# Altium project SynthyTwo.Project.PrjPcb (part 1 of 2)
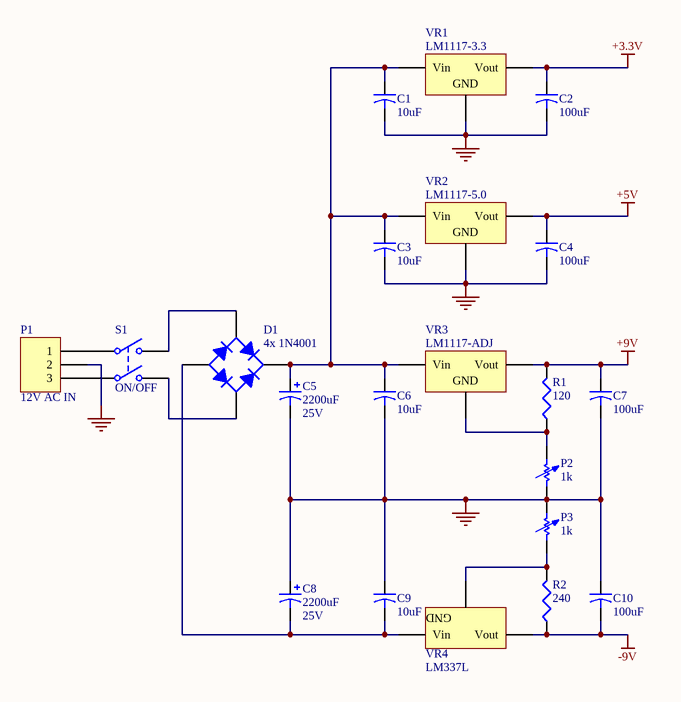
[diagram p0: PSU.Schematic.SchDoc]
11 sheets, 1148 parts. Net scope: hierarchical (ports join the sheet entries above them; power ports are global).
Board file: PCBROUTAGE.PcbDoc
Sheets:
  PSU.Schematic.SchDoc
  LINK_Filter.SchDoc
    Filtres = FilterBoard.Schematic.SchDoc
    DAC = DAC.Schematic.SchDoc
    Controle du Filtre = FilterControl.Schematic.SchDoc
    Multiplexeur = Output.Schematic.SchDoc
  LINK_PIC.SchDoc
    PIC = PIC.Schematic.SchDoc
    LED1 = Display.Schematic.SchDoc
    LED2 = Display.Schematic.SchDoc
    LED3 = Display.Schematic.SchDoc
    LED4 = Display.Schematic.SchDoc
    LED5 = Display.Schematic.SchDoc
    LED6 = Display.Schematic.SchDoc
    LED7 = Display.Schematic.SchDoc
    LED8 = Display.Schematic.SchDoc
    LED9 = Display.Schematic.SchDoc
    SWITCH 1 = Display.Schematic.SchDoc
    SWITCH 2 = Display.Schematic.SchDoc
    SWITCH 3 = Display.Schematic.SchDoc
    SWITCH 4 = Display.Schematic.SchDoc
    SWITCH 5 = Display.Schematic.SchDoc
    SCK = DAC.Schematic.SchDoc
    DATA = DAC.Schematic.SchDoc
    BCK = DAC.Schematic.SchDoc
    LRCK = DAC.Schematic.SchDoc
    RS = Display.Schematic.SchDoc
    ENABLE = Display.Schematic.SchDoc
    DATA  4 = Display.Schematic.SchDoc
    DATA 5 = Display.Schematic.SchDoc
    DATA 6 = Display.Schematic.SchDoc
    DATA 7 = Display.Schematic.SchDoc
    MIDI IN = MIDI.Schematic.SchDoc
    Frequency = FilterControl.Schematic.SchDoc
    Resonance = FilterControl.Schematic.SchDoc
    Mod = FilterControl.Schematic.SchDoc
    A0 = Output.Schematic.SchDoc
    A1 = Output.Schematic.SchDoc
    A0 = Encodeurs.Schematic.SchDoc
    A1 = Encodeurs.Schematic.SchDoc
    B0 = Encodeurs.Schematic.SchDoc
    B1 = Encodeurs.Schematic.SchDoc
    C0 = Encodeurs.Schematic.SchDoc
    C1 = Encodeurs.Schematic.SchDoc
    D0 = Encodeurs.Schematic.SchDoc
    D1 = Encodeurs.Schematic.SchDoc

## Sheet PSU.Schematic.SchDoc
size A

### Parts
C1  10uF  [CAPR5-4X5]
C2  100uF  [CAPR5-4X5]
C3  10uF  [CAPR5-4X5]
C4  100uF  [CAPR5-4X5]
C5  2200uF  value 25V  [RB7.6-15]
C6  10uF  [CAPR5-4X5]
C7  100uF  [CAPR5-4X5]
C8  2200uF  value 25V  [RB7.6-15]
C9  10uF  [CAPR5-4X5]
C10  100uF  [CAPR5-4X5]
D1  4x 1N4001  [D-38]
P1  12V AC IN  [HDR1X3]
P2  1k  [AXIAL-0.7]
P3  1k  [AXIAL-0.7]
R1  120  [J1-0603]
R2  240  [J1-0603]
S1  ON/OFF  [DPST-4]
VR1  LM1117-3.3  [D2PAK_N]
VR2  LM1117-5.0  [D2PAK_N]
VR3  LM1117-ADJ  [D2PAK_N]
VR4  LM337L  [D2PAK_N]

### Nets
+3.3V: C2.1 VR1.3(Vout)
+5V: C4.1 VR2.3(Vout)
+9V: C7.1 R1.2 VR3.3(Vout)
-9V: C10.2 R2.1 VR4.3(Vout)
GND: C1.2 C2.2 C3.2 C4.2 C5.2 C6.2 C7.2 C8.1 C9.1 C10.1 P1.2 P2.1 P3.2 VR1.2(GND) VR2.2(GND)
NetC1_1: C1.1 C3.1 C5.1 C6.1 D1.1(K) VR1.1(Vin) VR2.1(Vin) VR3.1(Vin)
NetC8_2: C8.2 C9.2 D1.3(A) VR4.1(Vin)
NetD1_2: D1.2(C) S1.4(NO2)
NetD1_4: D1.4(C) S1.2(NO1)
NetP1_1: P1.1 S1.1(COMMON1)
NetP1_3: P1.3 S1.3(COMMON2)
NetP2_2: P2.2 R1.1 VR3.2(ADJ)
NetP3_1: P3.1 R2.2 VR4.2(ADJ)

### Notes on the sheet
- (in symbol Volt Reg) GND

### Library data of the parts
C1 C3 C6 C9 = Cap2: Capacitor; Value: 10u; Published: 23-Sep-2002; PackageReference: CAPR5-4X5; Publisher: Altium Limited; PackageDescription: Capacitor; 2 Leads
C2 C4 C7 C10 = Cap2: Capacitor; Value: 100u; Published: 23-Sep-2002; PackageReference: CAPR5-4X5; Publisher: Altium Limited; PackageDescription: Capacitor; 2 Leads
C5 C8 = Cap Pol1: Polarized Capacitor (Radial); Published: 8-Jun-2000; LatestRevisionDate: 17-Jul-2002; LatestRevisionNote: Re-released for DXP Platform.; PackageReference: RB7.6-15; Publisher: Altium Limited; PackageDescription: Polarized Capacitor (Radial); 2 Leads
D1 = Bridge1: Full Wave Diode Bridge; Published: 8-Jun-2000; LatestRevisionDate: 29-May-2009; LatestRevisionNote: Sch pins A & K swapped.; DatasheetVersion: E2732B; PackageReference: D-38; Publisher: Altium Limited; PackageDescription: Bridge Rectifier; 4 Terminals; Body 9.4 x 9.4 mm (typ); Pitch 5.08 mm
P1 = Header 3: Header, 3-Pin; LatestRevisionDate: 17-Jul-2002; LatestRevisionNote: Re-released for DXP Platform.; Publisher: Altium Limited
P2 P3 = Res Adj1: Variable Resistor; Set Position: 0.5; Published: 8-Jun-2000; LatestRevisionDate: 17-Jul-2002; LatestRevisionNote: Re-released for DXP Platform.; PackageReference: AXIAL-0.7; Publisher: Altium Limited; PackageDescription: Axial Device, Thru-Hole; 2 Leads; 0.7 in Pin Spacing; Value: 1K
R1 R2 = Res3: Resistor; Published: 8-Jun-2000; LatestRevisionDate: 29-May-2009; LatestRevisionNote: IPC-7351 Footprint Added.; PackageReference: J1-0603; Publisher: Altium Limited; PackageDescription: Chip Resistor
  R1: Value: 120
  R2: Value: 240
S1 = SW-DPST: Double-Pole, Single-Throw Switch; Published: 24-Mar-1999; LatestRevisionDate: 17-Jul-2002; LatestRevisionNote: Re-released for DXP Platform.; PackageReference: DPST-4; Publisher: Altium Limited; PackageDescription: Switch; 4 Leads
VR1-VR4 = Volt Reg: Voltage Regulator; Published: 24-Mar-1999; LatestRevisionDate: 29-May-2009; LatestRevisionNote: IPC-7351 Footprint Added.; PackageReference: D2PAK; Publisher: Altium Limited; PackageDescription: 3-Pin Transistor Outline Package 2.54 mm Pitch, 15.1 mm Lead Span

## Sheet LINK_Filter.SchDoc
size A
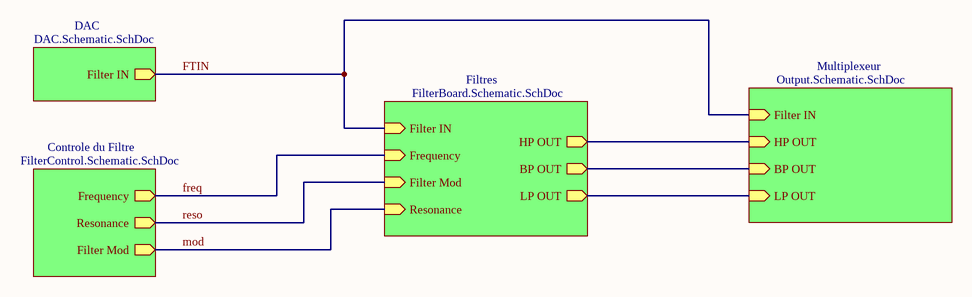
[diagram p1: LINK_Filter.SchDoc]

### Sub-sheets
Controle du Filtre = FilterControl.Schematic.SchDoc: Frequency (out), Resonance (out), Filter Mod (out)
DAC = DAC.Schematic.SchDoc: Filter IN (out)
Filtres = FilterBoard.Schematic.SchDoc: Filter IN (in), Filter Mod (in), Frequency (in), Resonance (in), BP OUT (out), HP OUT (out), LP OUT (out)
Multiplexeur = Output.Schematic.SchDoc: Filter IN (in), BP OUT (in), HP OUT (in), LP OUT (in)

### Nets
BPO: sheet Filtres/BP OUT, sheet Multiplexeur/BP OUT
freq: sheet Filtres/Frequency, sheet Controle du Filtre/Frequency
FTIN: sheet Filtres/Filter IN, sheet DAC/Filter IN, sheet Multiplexeur/Filter IN
HPO: sheet Filtres/HP OUT, sheet Multiplexeur/HP OUT
LPO: sheet Filtres/LP OUT, sheet Multiplexeur/LP OUT
mod: sheet Filtres/Resonance, sheet Controle du Filtre/Filter Mod
reso: sheet Filtres/Filter Mod, sheet Controle du Filtre/Resonance

## Sheet FilterBoard.Schematic.SchDoc
size B
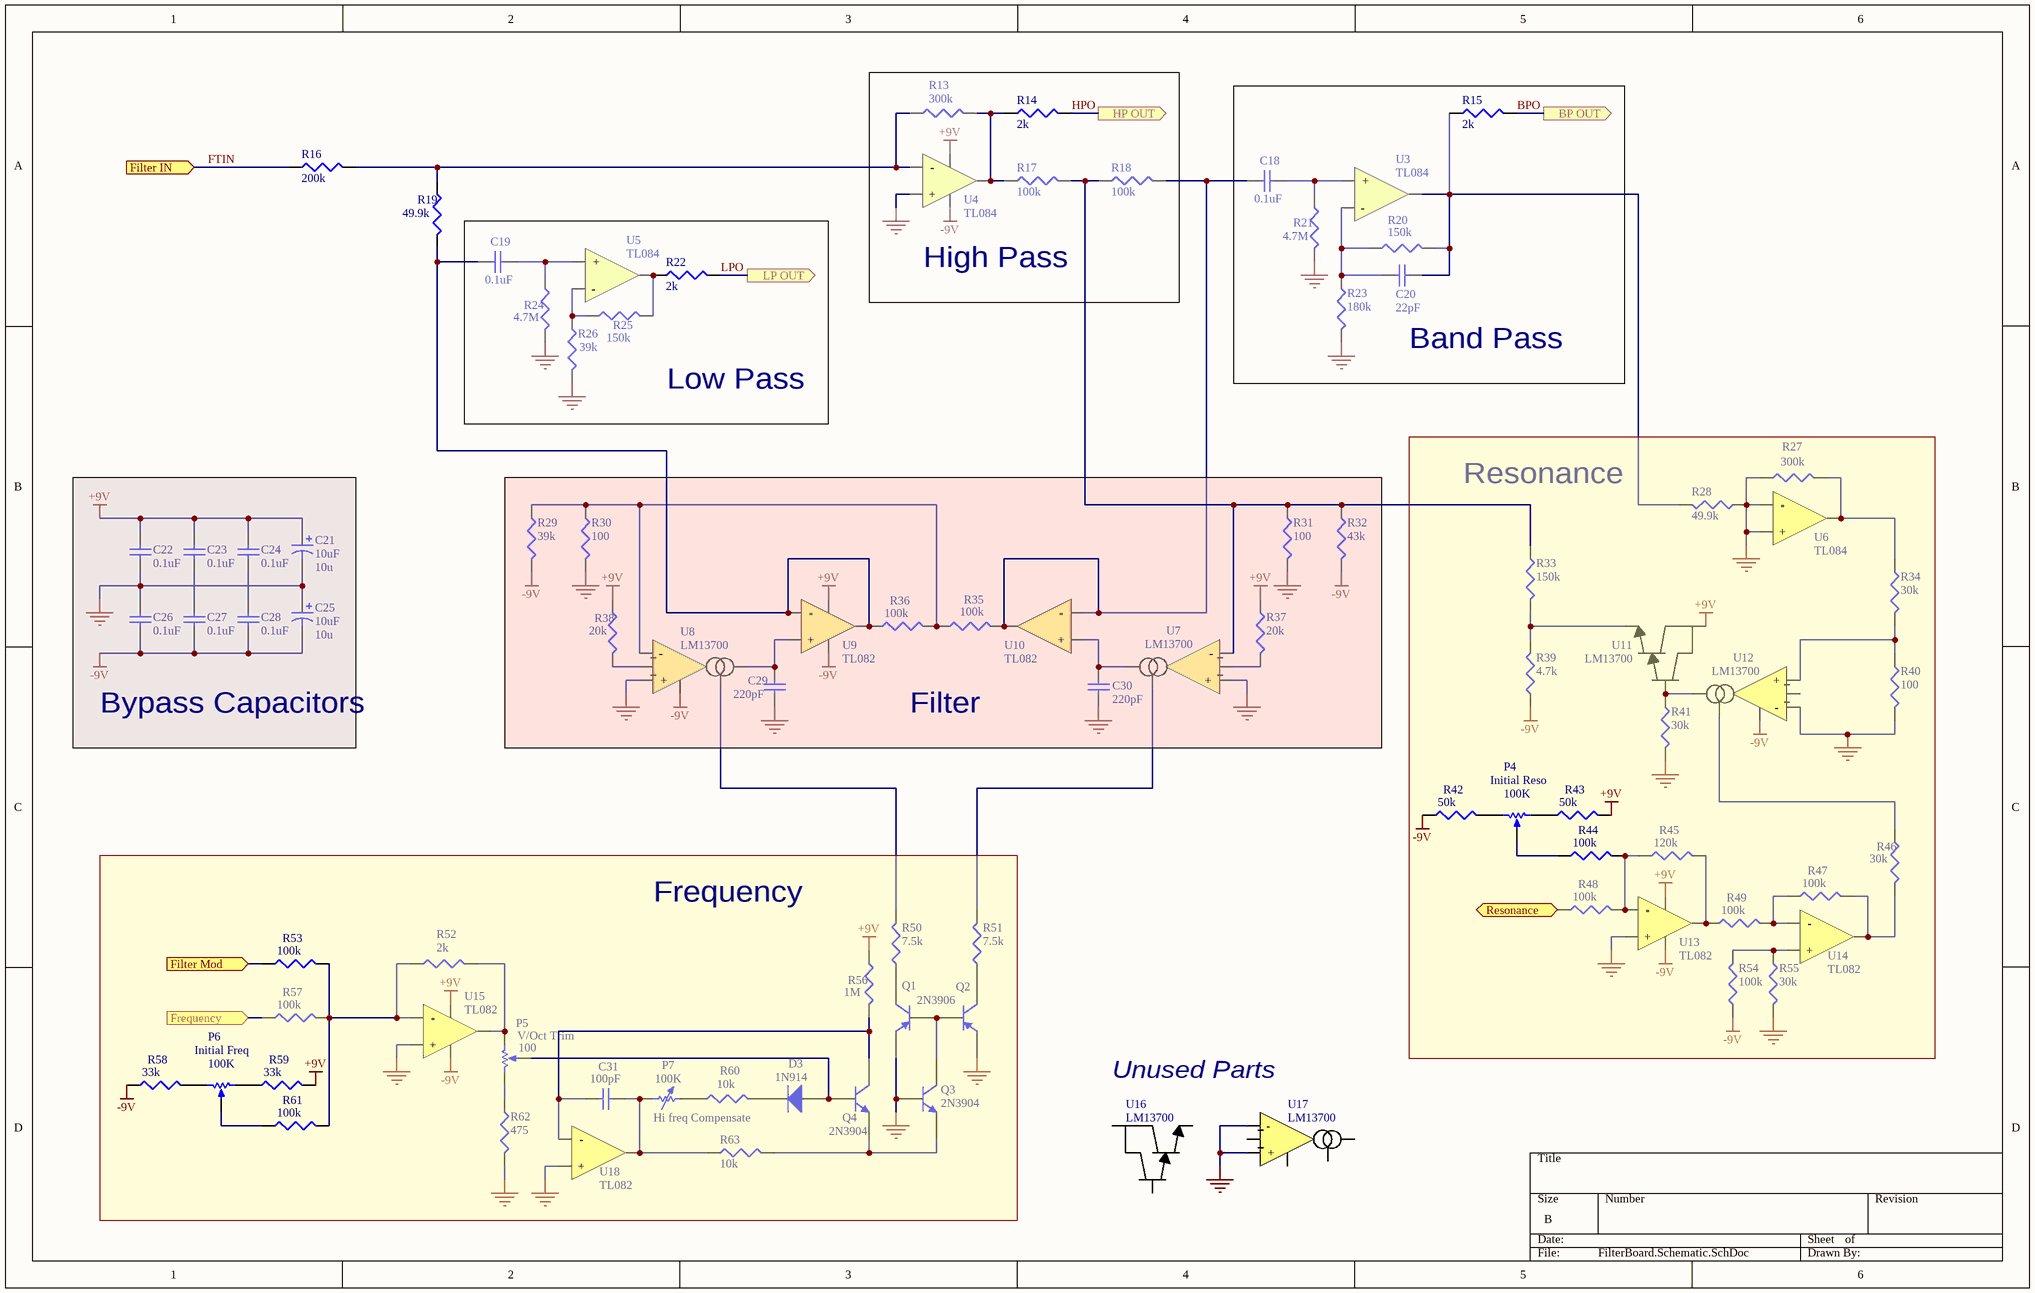
[diagram p2: FilterBoard.Schematic.SchDoc]

### Parts
C18  0.1uF  [C1206]
C19  0.1uF  [C1206]
C20  22pF  [C1206]
C21  10uF  value 10u  [RB7.6-15]
C22  0.1uF  [C1206]
C23  0.1uF  [C1206]
C24  0.1uF  [C1206]
C25  10uF  value 10u  [RB7.6-15]
C26  0.1uF  [C1206]
C27  0.1uF  [C1206]
C28  0.1uF  [C1206]
C29  220pF  [C1206]
C30  220pF  [C1206]
C31  100pF  [C1206]
D3  1N914  [DO-41]
P4  Initial Reso  value 100K  [VR5]
P5  V/Oct Trim  value 100  [VR5]
P6  Initial Freq  value 100K  [VR5]
P7  Hi freq Compensate  value 100K  [AXIAL-0.7]
Q1  2N3906  [TO-92A]
Q2  2N3906  [TO-92A]  (value not drawn)
Q3  2N3904  [TO-92A]
Q4  2N3904  [TO-92A]
R13  300k  [J1-0603]
R14  2k  [J1-0603]
R15  2k  [J1-0603]
R16  200k  [J1-0603]
R17  100k  [J1-0603]
R18  100k  [J1-0603]
R19  49.9k  [J1-0603]
R20  150k  [J1-0603]
R21  4.7M  [J1-0603]
R22  2k  [J1-0603]
R23  180k  [J1-0603]
R24  4.7M  [J1-0603]
R25  150k  [J1-0603]
R26  39k  [J1-0603]
R27  300k  [J1-0603]
R28  49.9k  [J1-0603]
R29  39k  [J1-0603]
R30  100  [J1-0603]
R31  100  [J1-0603]
R32  43k  [J1-0603]
R33  150k  [J1-0603]
R34  30k  [J1-0603]
R35  100k  [J1-0603]
R36  100k  [J1-0603]
R37  20k  [J1-0603]
R38  20k  [J1-0603]
R39  4.7k  [J1-0603]
R40  100  [J1-0603]
R41  30k  [J1-0603]
R42  50k  [J1-0603]
R43  50k  [J1-0603]
R44  100k  [J1-0603]
R45  120k  [J1-0603]
R46  30k  [J1-0603]
R47  100k  [J1-0603]
R48  100k  [J1-0603]
R49  100k  [J1-0603]
R50  7.5k  [J1-0603]
R51  7.5k  [J1-0603]
R52  2k  [J1-0603]
R53  100k  [J1-0603]
R54  100k  [J1-0603]
R55  30k  [J1-0603]
R56  1M  [J1-0603]
R57  100k  [J1-0603]
R58  33k  [J1-0603]
R59  33k  [J1-0603]
R60  10k  [J1-0603]
R61  100k  [J1-0603]
R62  475  [J1-0603]
R63  10k  [J1-0603]
U3  TL084
U4  TL084
U5  TL084
U6  TL084
U7  LM13700
U8  LM13700
U9  TL082
U10  TL082
U11  LM13700
U12  LM13700
U13  TL082
U14  TL082
U15  TL082
U16  LM13700
U17  LM13700
U18  TL082

### Blocks framed on the sheet
High Pass: R13 R14 R17 R18 U4
Band Pass: C18 C20 R15 R20 R21 R23 U3
Low Pass: C19 R22 R24-R26 U5
Resonance: P4 R27 R28 R33 R34 R39-R49 R54 R55 U6 U11-U14
Bypass Capacitors: C21-C28
Filter: C29 C30 R29-R32 R35-R38 U7-U10
Frequency: C31 D3 P5-P7 Q1-Q4 R50-R53 R56-R63 U15 U18

### Ports
BP OUT (out), Filter IN (in), Filter Mod (in), Frequency (in), HP OUT (out), LP OUT (out), Resonance (in)

### Nets
+9V: C21.1 C22.2 C23.2 C24.2 R37.1 R38.1 R43.2 R56.1 R59.2 U4.4(VCC+) U9.8(VCC+) U11.11(V+) U13.8(VCC+) U15.8(VCC+)
-9V: C25.2 C26.1 C27.1 C28.1 R29.2 R32.2 R39.1 R42.1 R54.1 R58.1 U4.11(VCC-) U8.6(VCC-) U9.4(VCC-) U12.6(VCC-) U13.4(VCC-) U15.4(VCC-)
GND: C21.2 C22.1 C25.1 C26.2 C29.1 C30.1 Q1.1(E) Q2.1(E) Q3.2(B) R21.2 R23.2 R24.2 R26.2 R27.1 R28.1 R30.2 R31.2 R40.2 R41.2 R55.2 R62.2 U4.3(+) U6.12(-) U6.13(+) U7.3(+) U8.3(+) U12.3(-) U13.3(+) U15.3(+) U17.3(+) U17.4(-) U18.5(+)
BPO: R15.2 ; port BP OUT
freq: R57.1 ; port Frequency
FTIN: R16.1 ; port Filter IN
HPO: R14.2 ; port HP OUT
LPO: R22.2 ; port LP OUT
mod: R48.1 ; port Resonance
reso: R53.1 ; port Filter Mod
NetC18_1: C18.1 R18.2 R35.2 U10.6(-) U10.7(OUT)
NetC18_2: C18.2 R21.1 U3.5(+)
NetC19_1: C19.1 R19.2 R36.1 U9.1(OUT) U9.2(-)
NetC19_2: C19.2 R24.1 U5.5(+)
NetC20_1: C20.1 R20.1 R23.1 U3.3(-)
NetC20_2: C20.2 R15.1 R20.2 R28.2 U3.7(OUT)
NetC23_1: C23.1 C27.2
NetC24_1: C24.1 C28.2
NetC29_2: C29.2 U8.5(OUT) U9.3(+)
NetC30_2: C30.2 U7.5(OUT) U10.5(+)
NetC31_1: C31.1 Q4.3(C) R56.2 U18.6(-)
NetC31_2: C31.2 P7.1 R63.1 U18.7(OUT)
NetD3_1: D3.1(A) P5.3(TAP) Q4.2(B)
NetD3_2: D3.2(K) R60.2
NetP4_1: P4.1(TOP) R43.1
NetP4_2: P4.2(BOT) R42.2
NetP4_3: P4.3(TAP) R44.1
NetP5_1: P5.1(TOP) R52.2 U15.1(OUT)
NetP5_2: P5.2(BOT) R62.1
NetP6_1: P6.1(TOP) R59.1
NetP6_2: P6.2(BOT) R58.2
NetP6_3: P6.3(TAP) R61.1
NetP7_2: P7.2 R60.1
NetQ1_2: Q1.2(B) Q2.2(B) Q3.3(C)
NetQ1_3: Q1.3(C) R50.1
NetQ2_3: Q2.3(C) R51.1
NetQ3_1: Q3.1(E) Q4.1(E) R63.2
NetR13_1: R13.1 R16.2 R19.1 U4.2(-)
NetR13_2: R13.2 R14.1 R17.1 U4.1(OUT)
NetR17_2: R17.2 R18.1 R31.1 R32.1 R33.1 U7.4(-)
NetR22_1: R22.1 R25.2 U5.7(OUT)
NetR25_1: R25.1 R26.1 U5.3(-)
NetR27_2: R27.2 R34.1 U6.14(OUT)
NetR29_1: R29.1 R30.1 R35.1 R36.2 U8.4(-)
NetR33_2: R33.2 R39.2 U11.8(BOUT)
NetR34_2: R34.2 R40.1 U12.4(+)
NetR37_2: R37.2 U7.2
NetR38_2: R38.2 U8.2
NetR41_1: R41.1 U11.7(BIN) U12.5(OUT)
NetR44_2: R44.2 R45.1 R48.2 U13.2(-)
NetR45_2: R45.2 R49.1 U13.1(OUT)
NetR46_1: R46.1 U12.1(BIAS)
NetR46_2: R46.2 R47.2 U14.7(OUT)
NetR47_1: R47.1 R49.2 U14.6(-)
NetR50_2: R50.2 U8.1(BIAS)
NetR51_2: R51.2 U7.1(BIAS)
NetR52_1: R52.1 R53.2 R57.2 R61.2 U15.2(-)
NetR54_2: R54.2 R55.1 U14.5(+)

Not connected (* = marked no-connect by the designer): U3 6(VCC+) 11(VCC-); U5 6(VCC+) 11(VCC-); U6 1(VCC+) 11(VCC-); U7 6(VCC-); U10 4(VCC-) 8(VCC+); U12 2; U14 4(VCC-) 8(VCC+); U16 7(BIN) 8(BOUT) 11(V+); U17 1(BIAS) 2 5(OUT) 6(VCC-); U18 4(VCC-) 8(VCC+)

### Notes on the sheet
- Unused Parts

### Library data of the parts
C18 C19 C22-C24 C26-C28 = Cap Semi: Capacitor (Semiconductor SIM Model); Value: 0.1u; Published: 8-Jun-2000; LatestRevisionDate: 29-May-2009; LatestRevisionNote: IPC-7351 Footprint Added.; PackageReference: C1206; Publisher: Altium Limited; PackageDescription: Chip Capacitor
C20 = Cap Semi: Capacitor (Semiconductor SIM Model); Value: 22p; Published: 8-Jun-2000; LatestRevisionDate: 29-May-2009; LatestRevisionNote: IPC-7351 Footprint Added.; PackageReference: C1206; Publisher: Altium Limited; PackageDescription: Chip Capacitor
C21 C25 = Cap Pol1: Polarized Capacitor (Radial); Published: 8-Jun-2000; LatestRevisionDate: 17-Jul-2002; LatestRevisionNote: Re-released for DXP Platform.; PackageReference: RB7.6-15; Publisher: Altium Limited; PackageDescription: Polarized Capacitor (Radial); 2 Leads
C29 C30 = Cap Semi: Capacitor (Semiconductor SIM Model); Value: 220p; Published: 8-Jun-2000; LatestRevisionDate: 29-May-2009; LatestRevisionNote: IPC-7351 Footprint Added.; PackageReference: C1206; Publisher: Altium Limited; PackageDescription: Chip Capacitor
C31 = Cap Semi: Capacitor (Semiconductor SIM Model); Value: 100p; Published: 8-Jun-2000; LatestRevisionDate: 29-May-2009; LatestRevisionNote: IPC-7351 Footprint Added.; PackageReference: C1206; Publisher: Altium Limited; PackageDescription: Chip Capacitor
D3 = Diode 1N4001: 1 Amp General Purpose Rectifier; Published: 8-Jun-2000; LatestRevisionDate: 17-Jul-2002; LatestRevisionNote: Re-released for DXP Platform.; DatasheetVersion: 1998; PackageVersion: Aug-1999; PackageReference: DO-41; Publisher: Altium Limited; PackageDescription: Diode, Axial; Body 5.2 x 2.7 mm (LxDia. max), Lead Dia. 0.86 mm (max); Code_JEDEC: DO-204-AL; ComponentLink1Description: Manufacturer Link; ComponentLink1URL: http://www.fairchildsemi.com/; ComponentLink2Description: Datasheet; ComponentLink2URL: http://www.fairchildsemi.com/ds/1N%2F1N4001.pdf
P4-P6 = RPot: Potentiometer; Sim Note: Enter the Resistance value and the set point into parameter fields.; Set Position: 0.5; Published: 8-Jun-2000; LatestRevisionDate: 17-Jul-2002; LatestRevisionNote: Re-released for DXP Platform.; PackageReference: VR5; Publisher: Altium Limited; PackageDescription: Variable Resistor, Thru-Hole; 3 Leads
P7 = Res Adj1: Variable Resistor; Set Position: 0.5; Published: 8-Jun-2000; LatestRevisionDate: 17-Jul-2002; LatestRevisionNote: Re-released for DXP Platform.; PackageReference: AXIAL-0.7; Publisher: Altium Limited; PackageDescription: Axial Device, Thru-Hole; 2 Leads; 0.7 in Pin Spacing
Q1 Q2 = 2N3906: PNP General Purpose Amplifier; Published: 8-Jun-2000; LatestRevisionDate: 15-Jan-2003; LatestRevisionNote: PCB Footprint 'BCY-W3/D4.7' replaced; DatasheetVersion: 1997; PackageVersion: Sep-1998; PackageReference: TO-92A; Publisher: Altium Limited; PackageDescription: TO, Flat Index; 3 In-Line, Axial Leads; Body Dia. 4.5mm; Leads 0.51 x 0.48 mm (max); ComponentLink1Description: Manufacturer Link; ComponentLink1URL: http://www.fairchildsemi.com/; ComponentLink2Description: Datasheet; ComponentLink2URL: http://www.fairchildsemi.com/ds/2N%2F2N3906.pdf
Q3 Q4 = 2N3904: NPN General Purpose Amplifier; Published: 8-Jun-2000; LatestRevisionDate: 15-Jan-2003; LatestRevisionNote: PCB Footprint 'BCY-W3/D4.7' replaced; DatasheetVersion: 1997; PackageVersion: Sep-1998; PackageReference: TO-92A; Publisher: Altium Limited; PackageDescription: TO, Flat Index; 3 In-Line, Axial Leads; Body Dia. 4.5mm; Leads 0.51 x 0.48 mm (max); ComponentLink1Description: Manufacturer Link; ComponentLink1URL: http://www.fairchildsemi.com/; ComponentLink2Description: Datasheet; ComponentLink2URL: http://www.fairchildsemi.com/ds/2N%2F2N3904.pdf
R13-R63 = Res3: Resistor; Published: 8-Jun-2000; LatestRevisionDate: 29-May-2009; LatestRevisionNote: IPC-7351 Footprint Added.; PackageReference: J1-0603; Publisher: Altium Limited; PackageDescription: Chip Resistor
  R13 R27: Value: 300K
  R14 R15 R22 R52: Value: 2K
  R16: Value: 200K
  R17 R18 R35 R36 R44 R47-R49 R53 R54 R57 R61: Value: 100K
  R19 R28: Value: 49.9K
  R20 R25 R33: Value: 150K
  R21 R24: Value: 4.7M
  R23: Value: 180K
  R26 R29: Value: 39K
  R30 R31 R40: Value: 100
  R32: Value: 43K
  R34 R41 R46 R55: Value: 30K
  R37 R38: Value: 20K
  R39: Value: 4.7K
  R42 R43: Value: 50K
  R45: Value: 120K
  R50 R51: Value: 7.5K
  R56: Value: 1M
  R58 R59: Value: 33K
  R60 R63: Value: 10K
  R62: Value: 475
U11 U16 = LM13700_1

## Sheet DAC.Schematic.SchDoc
size A
Used 5 times, as channels DAC, SCK, DATA, BCK, LRCK. Parts and nets are listed once, with the designators drawn on the sheet.
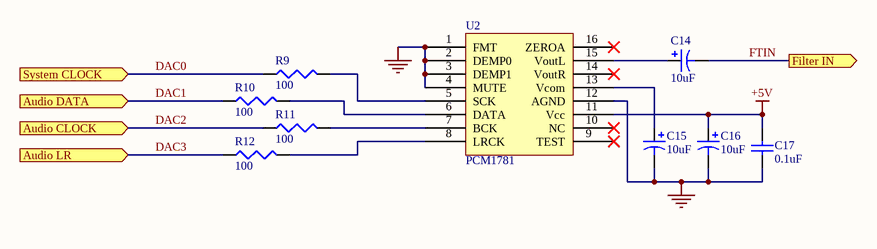
[diagram p3: DAC.Schematic.SchDoc]

### Parts
C14  10uF  [RB7.6-15]
C15  10uF  [RB7.6-15]
C16  10uF  [RB7.6-15]
C17  0.1uF  [C1206]
R9  100  [J1-0603]
R10  100  [J1-0603]
R11  100  [J1-0603]
R12  100  [J1-0603]
U2  PCM1781  [PCM1781]

### Ports
Audio CLOCK (in), Audio DATA (in), Audio LR (in), Filter IN (out), System CLOCK (in)

### Nets
+5V: C16.1 C17.2 U2.11(Vcc)
NetC15_2: C15.2 C16.2 C17.1 U2.1(FMT) U2.2(DEMP0) U2.3(DEMP1) U2.4(MUTE) U2.12(AGND)
DAC0: R9.1 ; port System CLOCK
DAC1: R10.1 ; port Audio DATA
DAC2: R11.1 ; port Audio CLOCK
DAC3: R12.1 ; port Audio LR
FTIN: C14.2 ; port Filter IN
NetC14_1: C14.1 U2.15(VoutL)
NetC15_1: C15.1 U2.13(Vcom)
NetR9_2: R9.2 U2.5(SCK)
NetR10_2: R10.2 U2.6(DATA)
NetR11_2: R11.2 U2.7(BCK)
NetR12_2: R12.2 U2.8(LRCK)

Not connected (* = marked no-connect by the designer): U2 9(TEST)* 10(NC)* 14(VoutR)* 16(ZEROA)*

### Channels
DAC: designators end in _DAC; ports Audio CLOCK=DAC2_DAC Audio DATA=DAC1_DAC Audio LR=DAC3_DAC Filter IN=FTIN System CLOCK=DAC0_DAC
SCK: designators end in _SCK; ports Audio CLOCK=DAC2_SCK Audio DATA=DAC1_SCK Audio LR=DAC3_SCK Filter IN=FTIN_SCK System CLOCK=DAC0
DATA: designators end in _DATA; ports Audio CLOCK=DAC2_DATA Audio DATA=DAC1 Audio LR=DAC3_DATA Filter IN=FTIN_DATA System CLOCK=DAC0_DATA
BCK: designators end in _BCK; ports Audio CLOCK=DAC2 Audio DATA=DAC1_BCK Audio LR=DAC3_BCK Filter IN=FTIN_BCK System CLOCK=DAC0_BCK
LRCK: designators end in _LRCK; ports Audio CLOCK=DAC2_LRCK Audio DATA=DAC1_LRCK Audio LR=DAC3 Filter IN=FTIN_LRCK System CLOCK=DAC0_LRCK

### Library data of the parts
C14-C16 = Cap Pol1: Polarized Capacitor (Radial); Published: 8-Jun-2000; LatestRevisionDate: 17-Jul-2002; LatestRevisionNote: Re-released for DXP Platform.; PackageReference: RB7.6-15; Publisher: Altium Limited; PackageDescription: Polarized Capacitor (Radial); 2 Leads; Value: 10uF
C17 = Cap Semi: as C18 on sheet FilterBoard.Schematic; Published: 8-Jun-2000; LatestRevisionDate: 29-May-2009; LatestRevisionNote: IPC-7351 Footprint Added.; PackageReference: C1206; Publisher: Altium Limited; PackageDescription: Chip Capacitor
R9-R12 = Res3: Resistor; Published: 8-Jun-2000; LatestRevisionDate: 29-May-2009; LatestRevisionNote: IPC-7351 Footprint Added.; PackageReference: J1-0603; Publisher: Altium Limited; PackageDescription: Chip Resistor; Value: 100
U2 = PCM1781 DAC

## Sheet FilterControl.Schematic.SchDoc
size A
Used 4 times, as channels Controle du Filtre, Frequency, Resonance, Mod. Parts and nets are listed once, with the designators drawn on the sheet.
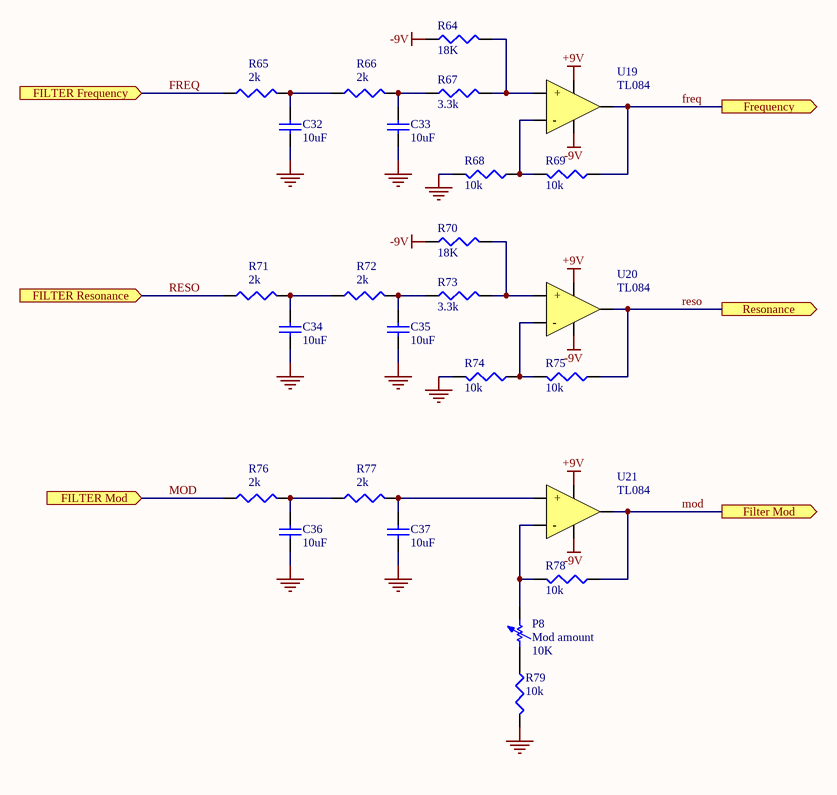
[diagram p4: FilterControl.Schematic.SchDoc]

### Parts
C32  10uF  [C1206]
C33  10uF  [C1206]
C34  10uF  [C1206]
C35  10uF  [C1206]
C36  10uF  [C1206]
C37  10uF  [C1206]
P8  Mod amount  value 10K  [AXIAL-0.7]
R64  18K  [J1-0603]
R65  2k  [J1-0603]
R66  2k  [J1-0603]
R67  3.3k  [J1-0603]
R68  10k  [J1-0603]
R69  10k  [J1-0603]
R70  18K  [J1-0603]
R71  2k  [J1-0603]
R72  2k  [J1-0603]
R73  3.3k  [J1-0603]
R74  10k  [J1-0603]
R75  10k  [J1-0603]
R76  2k  [J1-0603]
R77  2k  [J1-0603]
R78  10k  [J1-0603]
R79  10k  [J1-0603]
U19  TL084
U20  TL084
U21  TL084

### Ports
FILTER Frequency (in), FILTER Mod (in), Filter Mod (out), FILTER Resonance (in), Frequency (out), Resonance (out)

### Nets
+9V: U19.4(VCC+) U20.4(VCC+) U21.4(VCC+)
-9V: R64.1 R70.1 U19.11(VCC-) U20.11(VCC-) U21.11(VCC-)
GND: C32.1 C33.1 C34.1 C35.1 C36.1 C37.1 R68.2 R74.2 R79.2
FREQ: R65.1 R69.1 U19.1(OUT) ; port Frequency, port FILTER Frequency
MOD: R76.1 R78.1 U21.1(OUT) ; port Filter Mod, port FILTER Mod
RESO: R71.1 R75.1 U20.1(OUT) ; port Resonance, port FILTER Resonance
NetC32_2: C32.2 R65.2 R66.1
NetC33_2: C33.2 R66.2 R67.1
NetC34_2: C34.2 R71.2 R72.1
NetC35_2: C35.2 R72.2 R73.1
NetC36_2: C36.2 R76.2 R77.1
NetC37_2: C37.2 R77.2 U21.2(+)
NetP8_1: P8.1 R79.1
NetP8_2: P8.2 R78.2 U21.3(-)
NetR64_2: R64.2 R67.2 U19.2(+)
NetR68_1: R68.1 R69.2 U19.3(-)
NetR70_2: R70.2 R73.2 U20.2(+)
NetR74_1: R74.1 R75.2 U20.3(-)

### Channels
Controle du Filtre: designators end in _Controle_du_Filtre; ports FILTER Frequency=freq Filter Mod=mod FILTER Mod=mod FILTER Resonance=reso Frequency=freq Resonance=reso
Frequency: designators end in _Frequency; ports FILTER Frequency=FREQ Filter Mod=MOD_Frequency FILTER Mod=MOD_Frequency FILTER Resonance=RESO_Frequency Frequency=FREQ Resonance=RESO_Frequency
Resonance: designators end in _Resonance; ports FILTER Frequency=FREQ_Resonance Filter Mod=MOD_Resonance FILTER Mod=MOD_Resonance FILTER Resonance=RESO Frequency=FREQ_Resonance Resonance=RESO
Mod: designators end in _Mod; ports FILTER Frequency=FREQ_Mod Filter Mod=MOD FILTER Mod=MOD FILTER Resonance=RESO_Mod Frequency=FREQ_Mod Resonance=RESO_Mod

### Library data of the parts
C32-C37 = Cap Semi: Capacitor (Semiconductor SIM Model); Value: 10u; Published: 8-Jun-2000; LatestRevisionDate: 29-May-2009; LatestRevisionNote: IPC-7351 Footprint Added.; PackageReference: C1206; Publisher: Altium Limited; PackageDescription: Chip Capacitor
P8 = Res Adj1: Variable Resistor; Set Position: 0.5; Published: 8-Jun-2000; LatestRevisionDate: 17-Jul-2002; LatestRevisionNote: Re-released for DXP Platform.; PackageReference: AXIAL-0.7; Publisher: Altium Limited; PackageDescription: Axial Device, Thru-Hole; 2 Leads; 0.7 in Pin Spacing
R64-R79 = Res3: Resistor; Published: 8-Jun-2000; LatestRevisionDate: 29-May-2009; LatestRevisionNote: IPC-7351 Footprint Added.; PackageReference: J1-0603; Publisher: Altium Limited; PackageDescription: Chip Resistor
  R64 R70: Value: 18K
  R65 R66 R71 R72 R76 R77: Value: 2K
  R67 R73: Value: 3.3K
  R68 R69 R74 R75 R78 R79: Value: 10K

## Sheet Output.Schematic.SchDoc
size A
Used 3 times, as channels Multiplexeur, A0, A1. Parts and nets are listed once, with the designators drawn on the sheet.
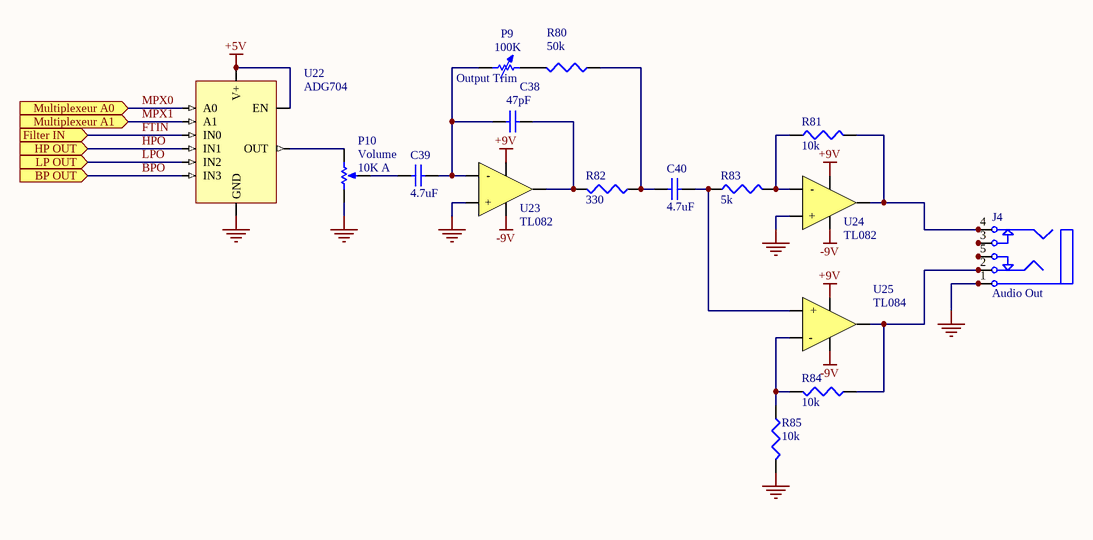
[diagram p5: Output.Schematic.SchDoc]

### Parts
C38  47pF  [CAPC1608N]
C39  4.7uF  [CAP1608N]
C40  4.7uF  [CAPC1608N]
J4  Audio Out  [ST-3150-5N]
P9  Output Trim  value 100K  [AXIAL-0.7]
P10  Volume  value 10K A  [VR5]
R80  50k  [CAPC1608N]
R81  10k  [CAPC1608N]
R82  330  [CAPC1608N]
R83  5k  [CAPC1608N]
R84  10k  [J1-0603]
R85  10k  [RESC6332]
U22  ADG704
U23  TL082
U24  TL082
U25  TL084

### Ports
BP OUT (in), Filter IN (in), HP OUT (in), LP OUT (in), Multiplexeur A0 (in), Multiplexeur A1 (in)

### Nets
+5V: U22.5(EN) U22.6(V+)
+9V: U23.8(VCC+) U24.8(VCC+) U25.4(VCC+)
-9V: U23.4(VCC-) U24.4(VCC-) U25.11(VCC-)
GND: J4.1 J4.1A J4.1B P10.1(TOP) R85.2 U22.3(GND) U23.3(+) U24.3(+)
BPO: U22.7(IN3) ; port BP OUT
FTIN: U22.2(IN0) ; port Filter IN
HPO: U22.9(IN1) ; port HP OUT
LPO: U22.4(IN2) ; port LP OUT
MPX0: U22.1(A0) ; port Multiplexeur A0
MPX1: U22.10(A1) ; port Multiplexeur A1
NetC38_1: C38.1 C39.2 P9.1 U23.2(-)
NetC38_2: C38.2 R82.2 U23.1(OUT)
NetC39_1: C39.1 P10.3(TAP)
NetC40_1: C40.1 R80.1 R82.1
NetC40_2: C40.2 R83.1 U25.2(+)
NetJ4_2: J4.2 J4.2A J4.2B R84.1 U25.1(OUT)
NetJ4_3: J4.3 J4.3A J4.3B
NetJ4_4: J4.4 J4.4A J4.4B R81.2 U24.1(OUT)
NetJ4_5: J4.5 J4.5A J4.5B
NetP9_2: P9.2 R80.2
NetP10_2: P10.2(BOT) U22.8(OUT)
NetR81_1: R81.1 R83.2 U24.2(-)
NetR84_2: R84.2 R85.1 U25.3(-)

### Channels
Multiplexeur: designators end in _Multiplexeur; ports BP OUT=BPO Filter IN=FTIN HP OUT=HPO LP OUT=LPO Multiplexeur A0=MPX0_Multiplexeur Multiplexeur A1=MPX1_Multiplexeur
A0: designators end in _A0; ports BP OUT=BPO_A0 Filter IN=FTIN_A0 HP OUT=HPO_A0 LP OUT=LPO_A0 Multiplexeur A0=MPX0 Multiplexeur A1=MPX1_A0
A1: designators end in _A1; ports BP OUT=BPO_A1 Filter IN=FTIN_A1 HP OUT=HPO_A1 LP OUT=LPO_A1 Multiplexeur A0=MPX0_A1 Multiplexeur A1=DIN

### Library data of the parts
C38 = Cap Semi: Capacitor (Semiconductor SIM Model); Published: 8-Jun-2000; LatestRevisionDate: 29-May-2009; LatestRevisionNote: IPC-7351 Footprint Added.; PackageReference: C1206; Publisher: Altium Limited; PackageDescription: Chip Capacitor; Value: 47pF
C39 C40 = Cap Semi: Capacitor (Semiconductor SIM Model); Value: 4.7u; Published: 8-Jun-2000; LatestRevisionDate: 29-May-2009; LatestRevisionNote: IPC-7351 Footprint Added.; PackageReference: C1206; Publisher: Altium Limited; PackageDescription: Chip Capacitor
J4 = Phonejack Stereo SW: 3-Conductor Jack with 2 break contacts (normals) and 2 auxiliary make contacts; Published: 5-Jan-2004; LatestRevisionDate: 17-Dec-2003; LatestRevisionNote: PCB Footprint replaced.; DatasheetDocument: 07-Mar-2000; Publisher: Altium Limited; ComponentLink1Description: Manufacturer Link; ComponentLink1URL: http://domino.kycon.com/internet/Products.html
P9 = Res Adj1: Variable Resistor; Set Position: 0.5; Published: 8-Jun-2000; LatestRevisionDate: 17-Jul-2002; LatestRevisionNote: Re-released for DXP Platform.; PackageReference: AXIAL-0.7; Publisher: Altium Limited; PackageDescription: Axial Device, Thru-Hole; 2 Leads; 0.7 in Pin Spacing
P10 = RPot: as P4 on sheet FilterBoard.Schematic; Published: 8-Jun-2000; LatestRevisionDate: 17-Jul-2002; LatestRevisionNote: Re-released for DXP Platform.; PackageReference: VR5; Publisher: Altium Limited; PackageDescription: Variable Resistor, Thru-Hole; 3 Leads
R80-R85 = Res3: Resistor; Published: 8-Jun-2000; LatestRevisionDate: 29-May-2009; LatestRevisionNote: IPC-7351 Footprint Added.; PackageReference: J1-0603; Publisher: Altium Limited; PackageDescription: Chip Resistor
  R80: Value: 50K
  R81 R84 R85: Value: 10K
  R82: Value: 330
  R83: Value: 5K

## Sheet LINK_PIC.SchDoc
size A
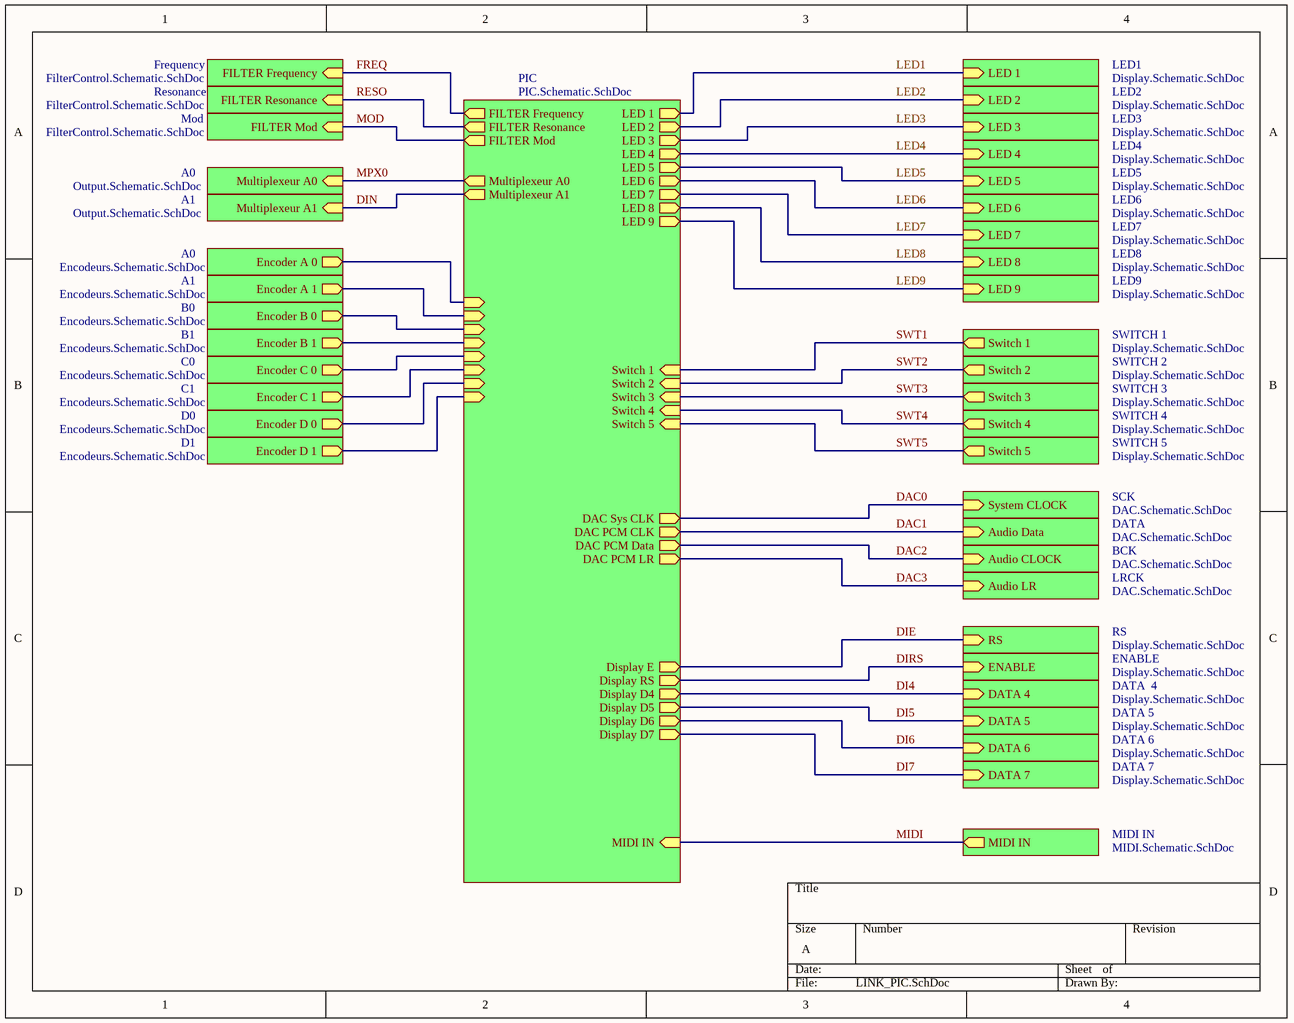
[diagram p6: LINK_PIC.SchDoc]

### Sub-sheets
A0 = Output.Schematic.SchDoc: Multiplexeur A0 (in)
A0 = Encodeurs.Schematic.SchDoc: Encoder A 0 (out)
A1 = Output.Schematic.SchDoc: Multiplexeur A1 (in)
A1 = Encodeurs.Schematic.SchDoc: Encoder A 1 (out)
B0 = Encodeurs.Schematic.SchDoc: Encoder B 0 (out)
B1 = Encodeurs.Schematic.SchDoc: Encoder B 1 (out)
BCK = DAC.Schematic.SchDoc: Audio CLOCK (in)
C0 = Encodeurs.Schematic.SchDoc: Encoder C 0 (out)
C1 = Encodeurs.Schematic.SchDoc: Encoder C 1 (out)
D0 = Encodeurs.Schematic.SchDoc: Encoder D 0 (out)
D1 = Encodeurs.Schematic.SchDoc: Encoder D 1 (out)
DATA = DAC.Schematic.SchDoc: Audio Data (in)
DATA 5 = Display.Schematic.SchDoc: DATA 5 (in)
DATA 6 = Display.Schematic.SchDoc: DATA 6 (in)
DATA 7 = Display.Schematic.SchDoc: DATA 7 (in)
DATA  4 = Display.Schematic.SchDoc: DATA 4 (in)
ENABLE = Display.Schematic.SchDoc: ENABLE (in)
Frequency = FilterControl.Schematic.SchDoc: FILTER Frequency (in)
LED1 = Display.Schematic.SchDoc: LED 1 (in)
LED2 = Display.Schematic.SchDoc: LED 2 (in)
LED3 = Display.Schematic.SchDoc: LED 3 (in)
LED4 = Display.Schematic.SchDoc: LED 4 (in)
LED5 = Display.Schematic.SchDoc: LED 5 (in)
LED6 = Display.Schematic.SchDoc: LED 6 (in)
LED7 = Display.Schematic.SchDoc: LED 7 (in)
LED8 = Display.Schematic.SchDoc: LED 8 (in)
LED9 = Display.Schematic.SchDoc: LED 9 (in)
LRCK = DAC.Schematic.SchDoc: Audio LR (in)
MIDI IN = MIDI.Schematic.SchDoc: MIDI IN (out)
Mod = FilterControl.Schematic.SchDoc: FILTER Mod (in)
PIC = PIC.Schematic.SchDoc: LED 2 (out), LED 1 (out), LED 4 (out), LED 3 (out), LED 6 (out), LED 5 (out), LED 8 (out), LED 7 (out), LED 9 (out), DAC Sys CLK (out), DAC PCM CLK (out), DAC PCM Data (out), DAC PCM LR (out), Switch 1 (in), Switch 2 (in), Switch 3 (in), Switch 4 (in), Switch 5 (in), Display D4 (out), Display D5 (out), Display D6 (out), Display D7 (out), Display E (out), Display RS (out), MIDI IN (in), FILTER Frequency (out), FILTER Resonance (out), FILTER Mod (out), Multiplexeur A0 (out), Multiplexeur A1 (out),  (in),  (in),  (in),  (in),  (in),  (in),  (in),  (in)
Resonance = FilterControl.Schematic.SchDoc: FILTER Resonance (in)
RS = Display.Schematic.SchDoc: RS (in)
SCK = DAC.Schematic.SchDoc: System CLOCK (in)
SWITCH 1 = Display.Schematic.SchDoc: Switch 1 (out)
SWITCH 2 = Display.Schematic.SchDoc: Switch 2 (out)
SWITCH 3 = Display.Schematic.SchDoc: Switch 3 (out)
SWITCH 4 = Display.Schematic.SchDoc: Switch 4 (out)
SWITCH 5 = Display.Schematic.SchDoc: Switch 5 (out)

### Nets
DAC0: sheet PIC/DAC Sys CLK, sheet SCK/System CLOCK
DAC1: sheet PIC/DAC PCM CLK, sheet DATA/Audio Data
DAC2: sheet PIC/DAC PCM Data, sheet BCK/Audio CLOCK
DAC3: sheet PIC/DAC PCM LR, sheet LRCK/Audio LR
DI4: sheet PIC/Display D4, sheet DATA  4/DATA 4
DI5: sheet PIC/Display D5, sheet DATA 5/DATA 5
DI6: sheet PIC/Display D6, sheet DATA 6/DATA 6
DI7: sheet PIC/Display D7, sheet DATA 7/DATA 7
DIE: sheet PIC/Display E, sheet RS/RS
DIN: sheet PIC/Multiplexeur A1, sheet A1/Multiplexeur A1
DIRS: sheet PIC/Display RS, sheet ENABLE/ENABLE  [project net DIE]
FREQ: sheet PIC/FILTER Frequency, sheet Frequency/FILTER Frequency
LED1: sheet PIC/LED 1, sheet LED1/LED 1
LED2: sheet PIC/LED 2, sheet LED2/LED 2
LED3: sheet PIC/LED 3, sheet LED3/LED 3
LED4: sheet PIC/LED 4, sheet LED4/LED 4
LED5: sheet PIC/LED 5, sheet LED5/LED 5
LED6: sheet PIC/LED 6, sheet LED6/LED 6
LED7: sheet PIC/LED 7, sheet LED7/LED 7
LED8: sheet PIC/LED 8, sheet LED8/LED 8
LED9: sheet PIC/LED 9, sheet LED9/LED 9
MIDI: sheet PIC/MIDI IN, sheet MIDI IN/MIDI IN
MOD: sheet PIC/FILTER Mod, sheet Mod/FILTER Mod
MPX0: sheet PIC/Multiplexeur A0, sheet A0/Multiplexeur A0
RESO: sheet PIC/FILTER Resonance, sheet Resonance/FILTER Resonance
SWT1: sheet PIC/Switch 1, sheet SWITCH 1/Switch 1  [project net SW1]
SWT2: sheet PIC/Switch 2, sheet SWITCH 2/Switch 2  [project net SW2]
SWT3: sheet PIC/Switch 3, sheet SWITCH 3/Switch 3  [project net SW3]
SWT4: sheet PIC/Switch 4, sheet SWITCH 4/Switch 4  [project net SW4]
SWT5: sheet PIC/Switch 5, sheet SWITCH 5/Switch 5  [project net SW5]
NetR108_A0_1: sheet PIC/, sheet PIC/, sheet PIC/, sheet PIC/, sheet PIC/, sheet PIC/, sheet PIC/, sheet PIC/, sheet A0/Encoder A 0, sheet A1/Encoder A 1, sheet B0/Encoder B 0, sheet B1/Encoder B 1, sheet C0/Encoder C 0, sheet C1/Encoder C 1, sheet D0/Encoder D 0, sheet D1/Encoder D 1

## Sheet PIC.Schematic.SchDoc
size A
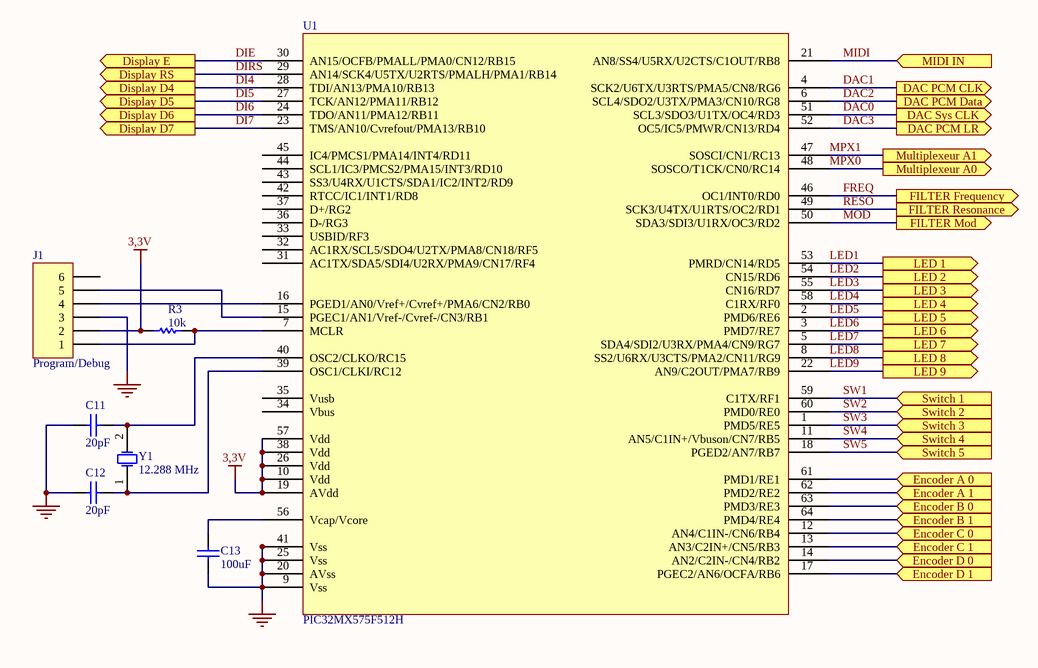
[diagram p7: PIC.Schematic.SchDoc]

### Parts
C11  20pF  [CAP1608N]
C12  20pF  [CAP1608N]
C13  value 100uF  [RAD-0.3]  (hidden comment: Cap)
J1  Program/Debug  [HDR1X6H]
R3  10k  [AXIAL-0.3]
U1  PIC32MX575F512H
Y1  12.288 MHz  [R38]

### Ports
DAC PCM CLK (out), DAC PCM Data (out), DAC PCM LR (out), DAC Sys CLK (out), Display D4 (out), Display D5 (out), Display D6 (out), Display D7 (out), Display E (out), Display RS (out), Encoder A 0 (in), Encoder A 1 (in), Encoder B 0 (in), Encoder B 1 (in), Encoder C 0 (in), Encoder C 1 (in), Encoder D 0 (in), Encoder D 1 (in), FILTER Frequency (out), FILTER Mod (out), FILTER Resonance (out), LED 1 (out), LED 2 (out), LED 3 (out), LED 4 (out), LED 5 (out), LED 6 (out), LED 7 (out), LED 8 (out), LED 9 (out), MIDI IN (in), Multiplexeur A0 (out), Multiplexeur A1 (out), Switch 1 (in), Switch 2 (in), Switch 3 (in), Switch 4 (in), Switch 5 (in)

### Nets
3,3V: J1.2 R3.2 U1.10(Vdd) U1.19(AVdd) U1.26(Vdd) U1.38(Vdd) U1.57(Vdd)
GND: C11.1 C12.1 C13.1 J1.3 U1.9(Vss) U1.20(AVss) U1.25(Vss) U1.41(Vss)
DAC0: U1.51(SCL3/SDO3/U1TX/OC4/RD3) ; port DAC Sys CLK
DAC1: U1.4(SCK2/U6TX/U3RTS/PMA5/CN8/RG6) ; port DAC PCM CLK
DAC2: U1.6(SCL4/SDO2/U3TX/PMA3/CN10/RG8) ; port DAC PCM Data
DAC3: U1.52(OC5/IC5/PMWR/CN13/RD4) ; port DAC PCM LR
DI4: U1.28(TDI/AN13/PMA10/RB13) ; port Display D4
DI5: U1.27(TCK/AN12/PMA11/RB12) ; port Display D5
DI6: U1.24(TDO/AN11/PMA12/RB11) ; port Display D6
DI7: U1.23(TMS/AN10/Cvrefout/PMA13/RB10) ; port Display D7
DIE: U1.30(AN15/OCFB/PMALL/PMA0/CN12/RB15) ; port Display E
DIRS: U1.29(AN14/SCK4/U5TX/U2RTS/PMALH/PMA1/RB14) ; port Display RS  [project net DIE]
FREQ: U1.46(OC1/INT0/RD0) ; port FILTER Frequency
LED1: U1.53(PMRD/CN14/RD5) ; port LED 1
LED2: U1.54(CN15/RD6) ; port LED 2
LED3: U1.55(CN16/RD7) ; port LED 3
LED4: U1.58(C1RX/RF0) ; port LED 4
LED5: U1.2(PMD6/RE6) ; port LED 5
LED6: U1.3(PMD7/RE7) ; port LED 6
LED7: U1.5(SDA4/SDI2/U3RX/PMA4/CN9/RG7) ; port LED 7
LED8: U1.8(SS2/U6RX/U3CTS/PMA2/CN11/RG9) ; port LED 8
LED9: U1.22(AN9/C2OUT/PMA7/RB9) ; port LED 9
MIDI: U1.21(AN8/SS4/U5RX/U2CTS/C1OUT/RB8) ; port MIDI IN
MOD: U1.50(SDA3/SDI3/U1RX/OC3/RD2) ; port FILTER Mod
MPX0: U1.48(SOSCO/T1CK/CN0/RC14) ; port Multiplexeur A0
MPX1: U1.47(SOSCI/CN1/RC13) ; port Multiplexeur A1  [project net DIN]
RESO: U1.49(SCK3/U4TX/U1RTS/OC2/RD1) ; port FILTER Resonance
SW1: U1.59(C1TX/RF1) ; port Switch 1
SW2: U1.60(PMD0/RE0) ; port Switch 2
SW3: U1.1(PMD5/RE5) ; port Switch 3
SW4: U1.11(AN5/C1IN+/Vbuson/CN7/RB5) ; port Switch 4
SW5: U1.18(PGED2/AN7/RB7) ; port Switch 5
NetC11_2: C11.2 U1.40(OSC2/CLKO/RC15) Y1.2(OSC2)
NetC12_2: C12.2 U1.39(OSC1/CLKI/RC12) Y1.1(OSC1)
NetC13_2: C13.2 U1.56(Vcap/Vcore)
NetJ1_1: J1.1 R3.1 U1.7(MCLR)
NetJ1_4: J1.4 U1.16(PGED1/AN0/Vref+/Cvref+/PMA6/CN2/RB0)
NetJ1_5: J1.5 U1.15(PGEC1/AN1/Vref-/Cvref-/CN3/RB1)
NetU1_12: U1.12(AN4/C1IN-/CN6/RB4) ; port Encoder C 0
NetU1_13: U1.13(AN3/C2IN+/CN5/RB3) ; port Encoder C 1
NetU1_14: U1.14(AN2/C2IN-/CN4/RB2) ; port Encoder D 0
NetU1_17: U1.17(PGEC2/AN6/OCFA/RB6) ; port Encoder D 1
NetU1_61: U1.61(PMD1/RE1) ; port Encoder A 0
NetU1_62: U1.62(PMD2/RE2) ; port Encoder A 1
NetU1_63: U1.63(PMD3/RE3) ; port Encoder B 0
NetU1_64: U1.64(PMD4/RE4) ; port Encoder B 1

Not connected (* = marked no-connect by the designer): J1 6; U1 31(AC1TX/SDA5/SDI4/U2RX/PMA9/CN17/RF4) 32(AC1RX/SCL5/SDO4/U2TX/PMA8/CN18/RF5) 33(USBID/RF3) 34(Vbus) 35(Vusb) 36(D-/RG3) 37(D+/RG2) 42(RTCC/IC1/INT1/RD8) 43(SS3/U4RX/U1CTS/SDA1/IC2/INT2/RD9) 44(SCL1/IC3/PMCS2/PMA15/INT3/RD10) 45(IC4/PMCS1/PMA14/INT4/RD11)

### Library data of the parts
C11 C12 = Cap Semi: Capacitor (Semiconductor SIM Model); Value: 20p; Published: 8-Jun-2000; LatestRevisionDate: 29-May-2009; LatestRevisionNote: IPC-7351 Footprint Added.; PackageReference: C1206; Publisher: Altium Limited; PackageDescription: Chip Capacitor
C13 = Cap: Capacitor; Published: 8-Jun-2000; LatestRevisionDate: 17-Jul-2002; LatestRevisionNote: Re-released for DXP Platform.; PackageReference: RAD-0.3; Publisher: Altium Limited; PackageDescription: Radial Cap, Thru-Hole; 2 Leads; 0.3 in Pin Spacing
J1 = Header 6H: Header, 6-Pin, Right Angle; LatestRevisionDate: 17-Jul-2002; LatestRevisionNote: Re-released for DXP Platform.; Publisher: Altium Limited
R3 = Res1: Resistor; Published: 8-Jun-2000; LatestRevisionDate: 17-Jul-2002; LatestRevisionNote: Re-released for DXP Platform.; PackageReference: AXIAL-0.3; Publisher: Altium Limited; PackageDescription: Axial Device, Thru-Hole; 2 Leads; 0.3 in Pin Spacing; Value: 10K
U1 = PIC32 MX575F512H
Y1 = XTAL: Crystal Oscillator; Published: 8-Jun-2000; LatestRevisionDate: 17-Jul-2002; LatestRevisionNote: Re-released for DXP Platform.; PackageReference: R38; Publisher: Altium Limited; PackageDescription: Crystal, Thru-Hole; 2 Leads; Body 3.1 x 8.2 mm (Dia.xH)

## Sheet Display.Schematic.SchDoc
size A
Used 20 times, as channels LED1, LED2, LED3, LED4, LED5, LED6, LED7, LED8, LED9, SWITCH 1, SWITCH 2, SWITCH 3, SWITCH 4, SWITCH 5, RS, ENABLE, DATA  4, DATA 5, DATA 6, DATA 7. Parts and nets are listed once, with the designators drawn on the sheet.
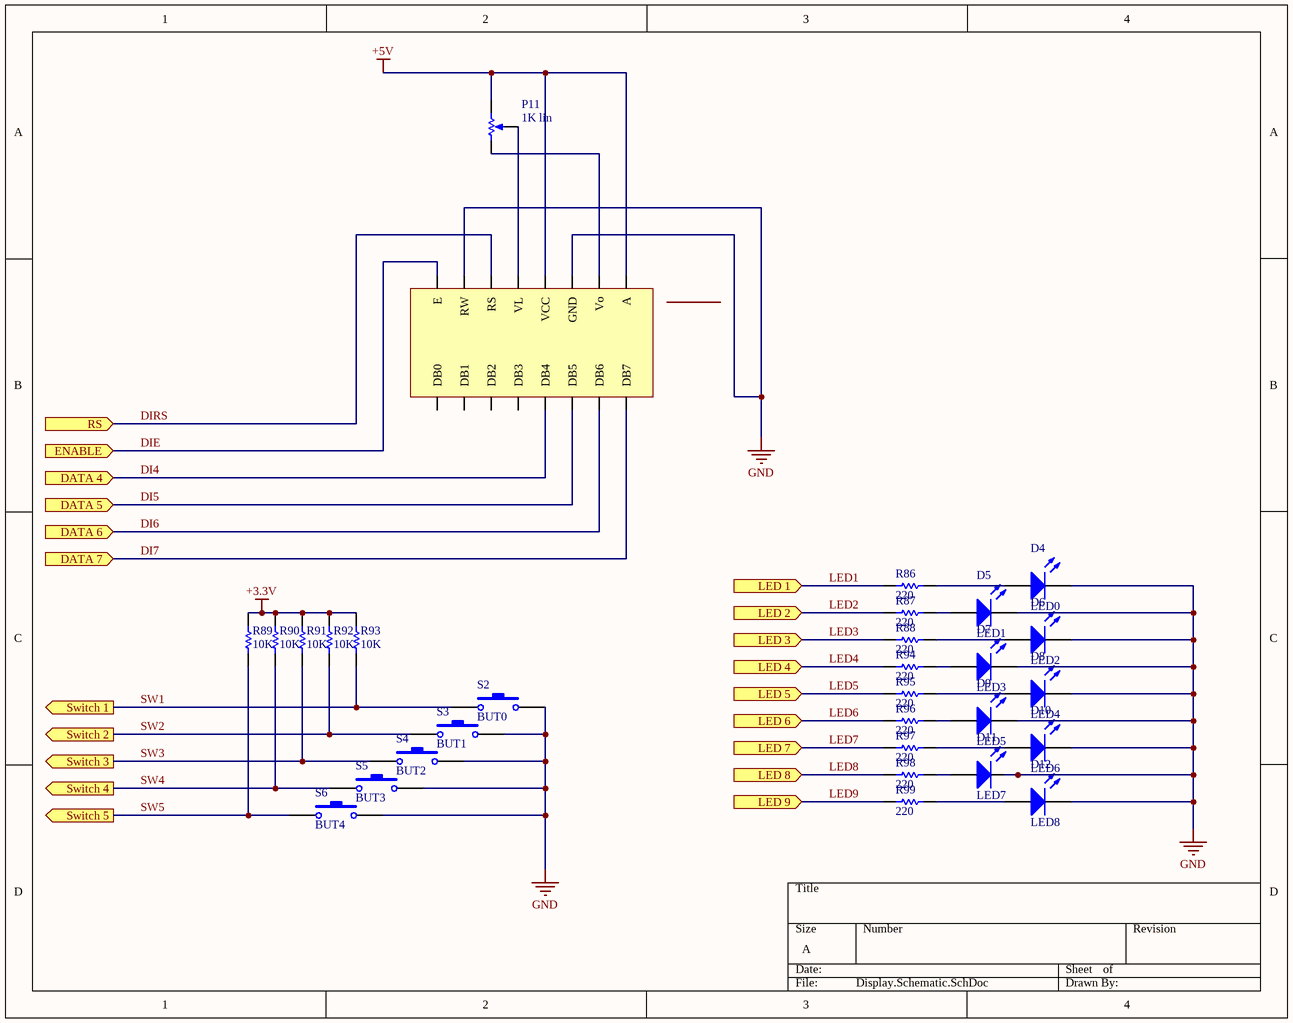
[diagram p8: Display.Schematic.SchDoc]

### Parts
*?  16x2 LCD  [Display]  (value not drawn)
D4  LED0  [LED-0]
D5  LED1  [LED-0]
D6  LED2  [LED-0]
D7  LED3  [LED-0]
D8  LED4  [LED-0]
D9  LED5  [LED-0]
D10  LED6  [LED-0]
D11  LED7  [LED-0]
D12  LED8  [LED-0]
P11  1K lin  [VR5]
R86  220  [CAPC1608N]
R87  220  [CAPC1608N]
R88  220  [CAPC1608N]
R89  10K  [CAPC1608N]
R90  10K  [CAPC1608N]
R91  10K  [CAPC1608N]
R92  10K  [CAPC1608N]
R93  10K  [CAPC1608N]
R94  220  [CAPC1608N]
R95  220  [CAPC1608N]
R96  220  [CAPC1608N]
R97  220  [CAPC1608N]
R98  220  [CAPC1608N]
R99  220  [CAPC1608N]
S2  BUT0  [SPST-2]
S3  BUT1  [SPST-2]
S4  BUT2  [SPST-2]
S5  BUT3  [SPST-2]
S6  BUT4  [SPST-2]

### Ports
DATA 4 (in), DATA 5 (in), DATA 6 (in), DATA 7 (in), ENABLE (in), LED 1 (in), LED 2 (in), LED 3 (in), LED 4 (in), LED 5 (in), LED 6 (in), LED 7 (in), LED 8 (in), LED 9 (in), RS (in), Switch 1 (out), Switch 2 (out), Switch 3 (out), Switch 4 (out), Switch 5 (out)

### Nets
+3.3V: R89.2 R90.2 R91.2 R92.2 R93.2
+5V: *?.2(VCC) *?.16(A) P11.2(BOT)
GND: *?.1(GND) *?.5(RW) D4.2(K) D5.2(K) D6.2(K) D7.2(K) D8.2(K) D9.2(K) D10.2(K) D11.2(K) D12.2(K) S2.2 S3.2 S4.2 S5.2 S6.2
DI4: *?.10(DB4) ; port DATA 4
DI5: *?.9(DB5) ; port DATA 5
DI6: *?.8(DB6) ; port DATA 6
DI7: *?.7(DB7) ; port DATA 7
DIE: *?.6(E) ; port ENABLE
DIRS: *?.4(RS) ; port RS
LED1: R86.1 ; port LED 1
LED2: R87.1 ; port LED 2
LED3: R88.1 ; port LED 3
LED4: R94.1 ; port LED 4
LED5: R95.1 ; port LED 5
LED6: R96.1 ; port LED 6
LED7: R97.1 ; port LED 7
LED8: R98.1 ; port LED 8
LED9: R99.1 ; port LED 9
SW1: R93.1 S2.1 ; port Switch 1
SW2: R92.1 S3.1 ; port Switch 2
SW3: R91.1 S4.1 ; port Switch 3
SW4: R90.1 S5.1 ; port Switch 4
SW5: R89.1 S6.1 ; port Switch 5
Net*?_3: *?.3(VL) P11.3(TAP)
Net*?_15: *?.15(Vo) P11.1(TOP)
NetD4_1: D4.1(A) R86.2
NetD5_1: D5.1(A) R87.2
NetD6_1: D6.1(A) R88.2
NetD7_1: D7.1(A) R94.2
NetD8_1: D8.1(A) R95.2
NetD9_1: D9.1(A) R96.2
NetD10_1: D10.1(A) R97.2
NetD11_1: D11.1(A) R98.2
NetD12_1: D12.1(A) R99.2

Not connected (* = marked no-connect by the designer): *? 11(DB3) 12(DB2) 13(DB1) 14(DB0)

### Channels
LED1: designators end in _LED1; ports DATA 4=DI4_LED1 DATA 5=DI5_LED1 DATA 6=DI6_LED1 DATA 7=DI7_LED1 ENABLE=DIE_LED1 LED 1=LED1 LED 2=LED2_LED1 LED 3=LED3_LED1 LED 4=LED4_LED1 LED 5=LED5_LED1 LED 6=LED6_LED1 LED 7=LED7_LED1 LED 8=LED8_LED1 LED 9=LED9_LED1 RS=DIRS_LED1 Switch 1=SW1_LED1 Switch 2=SW2_LED1 Switch 3=SW3_LED1 Switch 4=SW4_LED1 Switch 5=SW5_LED1
LED2: designators end in _LED2; ports DATA 4=DI4_LED2 DATA 5=DI5_LED2 DATA 6=DI6_LED2 DATA 7=DI7_LED2 ENABLE=DIE_LED2 LED 1=LED1_LED2 LED 2=LED2 LED 3=LED3_LED2 LED 4=LED4_LED2 LED 5=LED5_LED2 LED 6=LED6_LED2 LED 7=LED7_LED2 LED 8=LED8_LED2 LED 9=LED9_LED2 RS=DIRS_LED2 Switch 1=SW1_LED2 Switch 2=SW2_LED2 Switch 3=SW3_LED2 Switch 4=SW4_LED2 Switch 5=SW5_LED2
LED3: designators end in _LED3; ports DATA 4=DI4_LED3 DATA 5=DI5_LED3 DATA 6=DI6_LED3 DATA 7=DI7_LED3 ENABLE=DIE_LED3 LED 1=LED1_LED3 LED 2=LED2_LED3 LED 3=LED3 LED 4=LED4_LED3 LED 5=LED5_LED3 LED 6=LED6_LED3 LED 7=LED7_LED3 LED 8=LED8_LED3 LED 9=LED9_LED3 RS=DIRS_LED3 Switch 1=SW1_LED3 Switch 2=SW2_LED3 Switch 3=SW3_LED3 Switch 4=SW4_LED3 Switch 5=SW5_LED3
LED4: designators end in _LED4; ports DATA 4=DI4_LED4 DATA 5=DI5_LED4 DATA 6=DI6_LED4 DATA 7=DI7_LED4 ENABLE=DIE_LED4 LED 1=LED1_LED4 LED 2=LED2_LED4 LED 3=LED3_LED4 LED 4=LED4 LED 5=LED5_LED4 LED 6=LED6_LED4 LED 7=LED7_LED4 LED 8=LED8_LED4 LED 9=LED9_LED4 RS=DIRS_LED4 Switch 1=SW1_LED4 Switch 2=SW2_LED4 Switch 3=SW3_LED4 Switch 4=SW4_LED4 Switch 5=SW5_LED4
LED5: designators end in _LED5; ports DATA 4=DI4_LED5 DATA 5=DI5_LED5 DATA 6=DI6_LED5 DATA 7=DI7_LED5 ENABLE=DIE_LED5 LED 1=LED1_LED5 LED 2=LED2_LED5 LED 3=LED3_LED5 LED 4=LED4_LED5 LED 5=LED5 LED 6=LED6_LED5 LED 7=LED7_LED5 LED 8=LED8_LED5 LED 9=LED9_LED5 RS=DIRS_LED5 Switch 1=SW1_LED5 Switch 2=SW2_LED5 Switch 3=SW3_LED5 Switch 4=SW4_LED5 Switch 5=SW5_LED5
LED6: designators end in _LED6; ports DATA 4=DI4_LED6 DATA 5=DI5_LED6 DATA 6=DI6_LED6 DATA 7=DI7_LED6 ENABLE=DIE_LED6 LED 1=LED1_LED6 LED 2=LED2_LED6 LED 3=LED3_LED6 LED 4=LED4_LED6 LED 5=LED5_LED6 LED 6=LED6 LED 7=LED7_LED6 LED 8=LED8_LED6 LED 9=LED9_LED6 RS=DIRS_LED6 Switch 1=SW1_LED6 Switch 2=SW2_LED6 Switch 3=SW3_LED6 Switch 4=SW4_LED6 Switch 5=SW5_LED6
LED7: designators end in _LED7; ports DATA 4=DI4_LED7 DATA 5=DI5_LED7 DATA 6=DI6_LED7 DATA 7=DI7_LED7 ENABLE=DIE_LED7 LED 1=LED1_LED7 LED 2=LED2_LED7 LED 3=LED3_LED7 LED 4=LED4_LED7 LED 5=LED5_LED7 LED 6=LED6_LED7 LED 7=LED7 LED 8=LED8_LED7 LED 9=LED9_LED7 RS=DIRS_LED7 Switch 1=SW1_LED7 Switch 2=SW2_LED7 Switch 3=SW3_LED7 Switch 4=SW4_LED7 Switch 5=SW5_LED7
LED8: designators end in _LED8; ports DATA 4=DI4_LED8 DATA 5=DI5_LED8 DATA 6=DI6_LED8 DATA 7=DI7_LED8 ENABLE=DIE_LED8 LED 1=LED1_LED8 LED 2=LED2_LED8 LED 3=LED3_LED8 LED 4=LED4_LED8 LED 5=LED5_LED8 LED 6=LED6_LED8 LED 7=LED7_LED8 LED 8=LED8 LED 9=LED9_LED8 RS=DIRS_LED8 Switch 1=SW1_LED8 Switch 2=SW2_LED8 Switch 3=SW3_LED8 Switch 4=SW4_LED8 Switch 5=SW5_LED8
LED9: designators end in _LED9; ports DATA 4=DI4_LED9 DATA 5=DI5_LED9 DATA 6=DI6_LED9 DATA 7=DI7_LED9 ENABLE=DIE_LED9 LED 1=LED1_LED9 LED 2=LED2_LED9 LED 3=LED3_LED9 LED 4=LED4_LED9 LED 5=LED5_LED9 LED 6=LED6_LED9 LED 7=LED7_LED9 LED 8=LED8_LED9 LED 9=LED9 RS=DIRS_LED9 Switch 1=SW1_LED9 Switch 2=SW2_LED9 Switch 3=SW3_LED9 Switch 4=SW4_LED9 Switch 5=SW5_LED9
SWITCH 1: designators end in _SWITCH_1; ports DATA 4=DI4_SWITCH 1 DATA 5=DI5_SWITCH 1 DATA 6=DI6_SWITCH 1 DATA 7=DI7_SWITCH 1 ENABLE=DIE_SWITCH 1 LED 1=LED1_SWITCH 1 LED 2=LED2_SWITCH 1 LED 3=LED3_SWITCH 1 LED 4=LED4_SWITCH 1 LED 5=LED5_SWITCH 1 LED 6=LED6_SWITCH 1 LED 7=LED7_SWITCH 1 LED 8=LED8_SWITCH 1 LED 9=LED9_SWITCH 1 RS=DIRS_SWITCH 1 Switch 1=SW1 Switch 2=SW2_SWITCH 1 Switch 3=SW3_SWITCH 1 Switch 4=SW4_SWITCH 1 Switch 5=SW5_SWITCH 1
SWITCH 2: designators end in _SWITCH_2; ports DATA 4=DI4_SWITCH 2 DATA 5=DI5_SWITCH 2 DATA 6=DI6_SWITCH 2 DATA 7=DI7_SWITCH 2 ENABLE=DIE_SWITCH 2 LED 1=LED1_SWITCH 2 LED 2=LED2_SWITCH 2 LED 3=LED3_SWITCH 2 LED 4=LED4_SWITCH 2 LED 5=LED5_SWITCH 2 LED 6=LED6_SWITCH 2 LED 7=LED7_SWITCH 2 LED 8=LED8_SWITCH 2 LED 9=LED9_SWITCH 2 RS=DIRS_SWITCH 2 Switch 1=SW1_SWITCH 2 Switch 2=SW2 Switch 3=SW3_SWITCH 2 Switch 4=SW4_SWITCH 2 Switch 5=SW5_SWITCH 2
SWITCH 3: designators end in _SWITCH_3; ports DATA 4=DI4_SWITCH 3 DATA 5=DI5_SWITCH 3 DATA 6=DI6_SWITCH 3 DATA 7=DI7_SWITCH 3 ENABLE=DIE_SWITCH 3 LED 1=LED1_SWITCH 3 LED 2=LED2_SWITCH 3 LED 3=LED3_SWITCH 3 LED 4=LED4_SWITCH 3 LED 5=LED5_SWITCH 3 LED 6=LED6_SWITCH 3 LED 7=LED7_SWITCH 3 LED 8=LED8_SWITCH 3 LED 9=LED9_SWITCH 3 RS=DIRS_SWITCH 3 Switch 1=SW1_SWITCH 3 Switch 2=SW2_SWITCH 3 Switch 3=SW3 Switch 4=SW4_SWITCH 3 Switch 5=SW5_SWITCH 3
SWITCH 4: designators end in _SWITCH_4; ports DATA 4=DI4_SWITCH 4 DATA 5=DI5_SWITCH 4 DATA 6=DI6_SWITCH 4 DATA 7=DI7_SWITCH 4 ENABLE=DIE_SWITCH 4 LED 1=LED1_SWITCH 4 LED 2=LED2_SWITCH 4 LED 3=LED3_SWITCH 4 LED 4=LED4_SWITCH 4 LED 5=LED5_SWITCH 4 LED 6=LED6_SWITCH 4 LED 7=LED7_SWITCH 4 LED 8=LED8_SWITCH 4 LED 9=LED9_SWITCH 4 RS=DIRS_SWITCH 4 Switch 1=SW1_SWITCH 4 Switch 2=SW2_SWITCH 4 Switch 3=SW3_SWITCH 4 Switch 4=SW4 Switch 5=SW5_SWITCH 4
SWITCH 5: designators end in _SWITCH_5; ports DATA 4=DI4_SWITCH 5 DATA 5=DI5_SWITCH 5 DATA 6=DI6_SWITCH 5 DATA 7=DI7_SWITCH 5 ENABLE=DIE_SWITCH 5 LED 1=LED1_SWITCH 5 LED 2=LED2_SWITCH 5 LED 3=LED3_SWITCH 5 LED 4=LED4_SWITCH 5 LED 5=LED5_SWITCH 5 LED 6=LED6_SWITCH 5 LED 7=LED7_SWITCH 5 LED 8=LED8_SWITCH 5 LED 9=LED9_SWITCH 5 RS=DIRS_SWITCH 5 Switch 1=SW1_SWITCH 5 Switch 2=SW2_SWITCH 5 Switch 3=SW3_SWITCH 5 Switch 4=SW4_SWITCH 5 Switch 5=SW5
RS: designators end in _RS; ports DATA 4=DI4_RS DATA 5=DI5_RS DATA 6=DI6_RS DATA 7=DI7_RS ENABLE=DIE_RS LED 1=LED1_RS LED 2=LED2_RS LED 3=LED3_RS LED 4=LED4_RS LED 5=LED5_RS LED 6=LED6_RS LED 7=LED7_RS LED 8=LED8_RS LED 9=LED9_RS RS=DIE Switch 1=SW1_RS Switch 2=SW2_RS Switch 3=SW3_RS Switch 4=SW4_RS Switch 5=SW5_RS
ENABLE: designators end in _ENABLE; ports DATA 4=DI4_ENABLE DATA 5=DI5_ENABLE DATA 6=DI6_ENABLE DATA 7=DI7_ENABLE ENABLE=DIE LED 1=LED1_ENABLE LED 2=LED2_ENABLE LED 3=LED3_ENABLE LED 4=LED4_ENABLE LED 5=LED5_ENABLE LED 6=LED6_ENABLE LED 7=LED7_ENABLE LED 8=LED8_ENABLE LED 9=LED9_ENABLE RS=DIRS_ENABLE Switch 1=SW1_ENABLE Switch 2=SW2_ENABLE Switch 3=SW3_ENABLE Switch 4=SW4_ENABLE Switch 5=SW5_ENABLE
DATA  4: designators end in _DATA_4; ports DATA 4=DI4 DATA 5=DI5_DATA  4 DATA 6=DI6_DATA  4 DATA 7=DI7_DATA  4 ENABLE=DIE_DATA  4 LED 1=LED1_DATA  4 LED 2=LED2_DATA  4 LED 3=LED3_DATA  4 LED 4=LED4_DATA  4 LED 5=LED5_DATA  4 LED 6=LED6_DATA  4 LED 7=LED7_DATA  4 LED 8=LED8_DATA  4 LED 9=LED9_DATA  4 RS=DIRS_DATA  4 Switch 1=SW1_DATA  4 Switch 2=SW2_DATA  4 Switch 3=SW3_DATA  4 Switch 4=SW4_DATA  4 Switch 5=SW5_DATA  4
DATA 5: designators end in _DATA_5; ports DATA 4=DI4_DATA 5 DATA 5=DI5 DATA 6=DI6_DATA 5 DATA 7=DI7_DATA 5 ENABLE=DIE_DATA 5 LED 1=LED1_DATA 5 LED 2=LED2_DATA 5 LED 3=LED3_DATA 5 LED 4=LED4_DATA 5 LED 5=LED5_DATA 5 LED 6=LED6_DATA 5 LED 7=LED7_DATA 5 LED 8=LED8_DATA 5 LED 9=LED9_DATA 5 RS=DIRS_DATA 5 Switch 1=SW1_DATA 5 Switch 2=SW2_DATA 5 Switch 3=SW3_DATA 5 Switch 4=SW4_DATA 5 Switch 5=SW5_DATA 5
DATA 6: designators end in _DATA_6; ports DATA 4=DI4_DATA 6 DATA 5=DI5_DATA 6 DATA 6=DI6 DATA 7=DI7_DATA 6 ENABLE=DIE_DATA 6 LED 1=LED1_DATA 6 LED 2=LED2_DATA 6 LED 3=LED3_DATA 6 LED 4=LED4_DATA 6 LED 5=LED5_DATA 6 LED 6=LED6_DATA 6 LED 7=LED7_DATA 6 LED 8=LED8_DATA 6 LED 9=LED9_DATA 6 RS=DIRS_DATA 6 Switch 1=SW1_DATA 6 Switch 2=SW2_DATA 6 Switch 3=SW3_DATA 6 Switch 4=SW4_DATA 6 Switch 5=SW5_DATA 6
DATA 7: designators end in _DATA_7; ports DATA 4=DI4_DATA 7 DATA 5=DI5_DATA 7 DATA 6=DI6_DATA 7 DATA 7=DI7 ENABLE=DIE_DATA 7 LED 1=LED1_DATA 7 LED 2=LED2_DATA 7 LED 3=LED3_DATA 7 LED 4=LED4_DATA 7 LED 5=LED5_DATA 7 LED 6=LED6_DATA 7 LED 7=LED7_DATA 7 LED 8=LED8_DATA 7 LED 9=LED9_DATA 7 RS=DIRS_DATA 7 Switch 1=SW1_DATA 7 Switch 2=SW2_DATA 7 Switch 3=SW3_DATA 7 Switch 4=SW4_DATA 7 Switch 5=SW5_DATA 7

### Library data of the parts
*? = Display
D4-D12 = LED0: Typical INFRARED GaAs LED; Published: 8-Jun-2000; LatestRevisionDate: 08-Jul-2005; LatestRevisionNote: Mech Layer 1 removed.; PackageReference: LED-0; Publisher: Altium Limited; PackageDescription: LED; 2 Leads
P11 = RPot: Potentiometer; Sim Note: Enter the Resistance value and the set point into parameter fields.; Set Position: 0.5; Value: 10K; Published: 8-Jun-2000; LatestRevisionDate: 17-Jul-2002; LatestRevisionNote: Re-released for DXP Platform.; PackageReference: VR5; Publisher: Altium Limited; PackageDescription: Variable Resistor, Thru-Hole; 3 Leads
R86 R87 R89-R93 = Res1: Resistor; Value: 1K; Published: 8-Jun-2000; LatestRevisionDate: 17-Jul-2002; LatestRevisionNote: Re-released for DXP Platform.; PackageReference: AXIAL-0.3; Publisher: Altium Limited; PackageDescription: Axial Device, Thru-Hole; 2 Leads; 0.3 in Pin Spacing
R88 R94-R99 = Res1: Resistor; Published: 8-Jun-2000; LatestRevisionDate: 17-Jul-2002; LatestRevisionNote: Re-released for DXP Platform.; PackageReference: AXIAL-0.3; Publisher: Altium Limited; PackageDescription: Axial Device, Thru-Hole; 2 Leads; 0.3 in Pin Spacing; Value: 220
S2-S6 = SW-PB: Switch; Published: 24-Mar-1999; LatestRevisionDate: 17-Jul-2002; LatestRevisionNote: Re-released for DXP Platform.; PackageReference: SPST-2; Publisher: Altium Limited; PackageDescription: Switch; 2 Leads

## Sheet MIDI.Schematic.SchDoc
size A
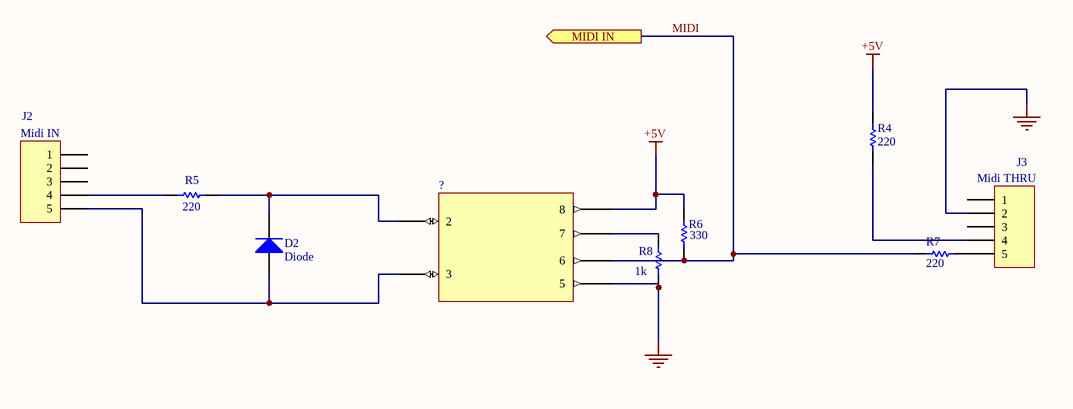
[diagram p9: MIDI.Schematic.SchDoc]

### Parts
?  6N139  [6N139]  (value not drawn)
D2  Diode  [SMC]
J2  Midi IN  [PCB DIN Socket]
J3  Midi THRU  [PCB DIN Socket]
R4  value 220  [AXIAL-0.3]  (hidden comment: Res1)
R5  value 220  [AXIAL-0.3]  (hidden comment: Res1)
R6  330  [AXIAL-0.3]
R7  value 220  [AXIAL-0.3]  (hidden comment: Res1)
R8  1k  [AXIAL-0.3]

### Ports
MIDI IN (out)

### Nets
+5V: ?.?3(8) R4.2 R6.2
GND: ?.?4(5) J3.2 R8.1
MIDI: ?.?6(6) R6.1 R7.2 ; port MIDI IN
Net?_?1: ?.?1(3) D2.1(A) J2.5
Net?_?2: ?.?2(2) D2.2(K) R5.2
Net?_?5: ?.?5(7) R8.2
NetJ2_4: J2.4 R5.1
NetJ3_4: J3.4 R4.1
NetJ3_5: J3.5 R7.1

Not connected (* = marked no-connect by the designer): J2 1 2 3; J3 1 3

### Library data of the parts
D2 = Diode: Default Diode; Published: 8-Jun-2000; LatestRevisionDate: 17-Jul-2002; LatestRevisionNote: Re-released for DXP Platform.; PackageVersion: Sep-1996; PackageReference: SMC; Publisher: Altium Limited; PackageDescription: DO-214-AB/SMC; 2 C-Bend Leads; Body 7.9 x 5.9 mm, inc. leads (LxW); Code_JEDEC: DO-214-AB
J2 J3 = Header 5: DIN 5 Pins; LatestRevisionDate: 17-Jul-2002; LatestRevisionNote: Re-released for DXP Platform.; Publisher: Altium Limited
R4-R8 = Res1: Resistor; Published: 8-Jun-2000; LatestRevisionDate: 17-Jul-2002; LatestRevisionNote: Re-released for DXP Platform.; PackageReference: AXIAL-0.3; Publisher: Altium Limited; PackageDescription: Axial Device, Thru-Hole; 2 Leads; 0.3 in Pin Spacing
  R6: Value: 330
  R8: Value: 1K